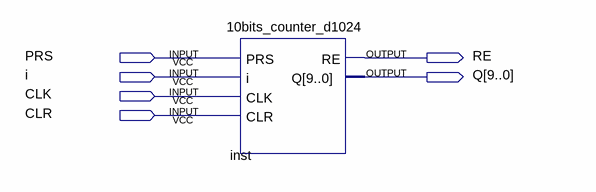
[diagram p0: schematic sheet]
// Quartus schematic test5.bdf as structural Verilog: 1 symbols, 6 pins
module test5 (
  input  PRS,
  input  i,
  input  CLK,
  input  CLR,
  output RE,
  output [9:0] Q
);

  \10bits_counter_d1024  inst (.PRS(PRS), .i(i), .CLK(CLK), .CLR(CLR), .RE(RE), .Q(Q));
endmodule
